# Altium schematic sheet MB1189.SchDoc: MB1189
size A3; Date: 9/24/2014; Author: P.A.; CompanyName: STMicroelectronics; Organization: Microcontrollers Division; Address1: 12, Rue Jules HOROWITZ; Address2: 38019 Grenoble; Address3: FRANCE; DocumentNumber: MB1189; Revision: B-07; SheetNumber: 1; SheetTotal: 12; Project: STM32F469I-DISCO
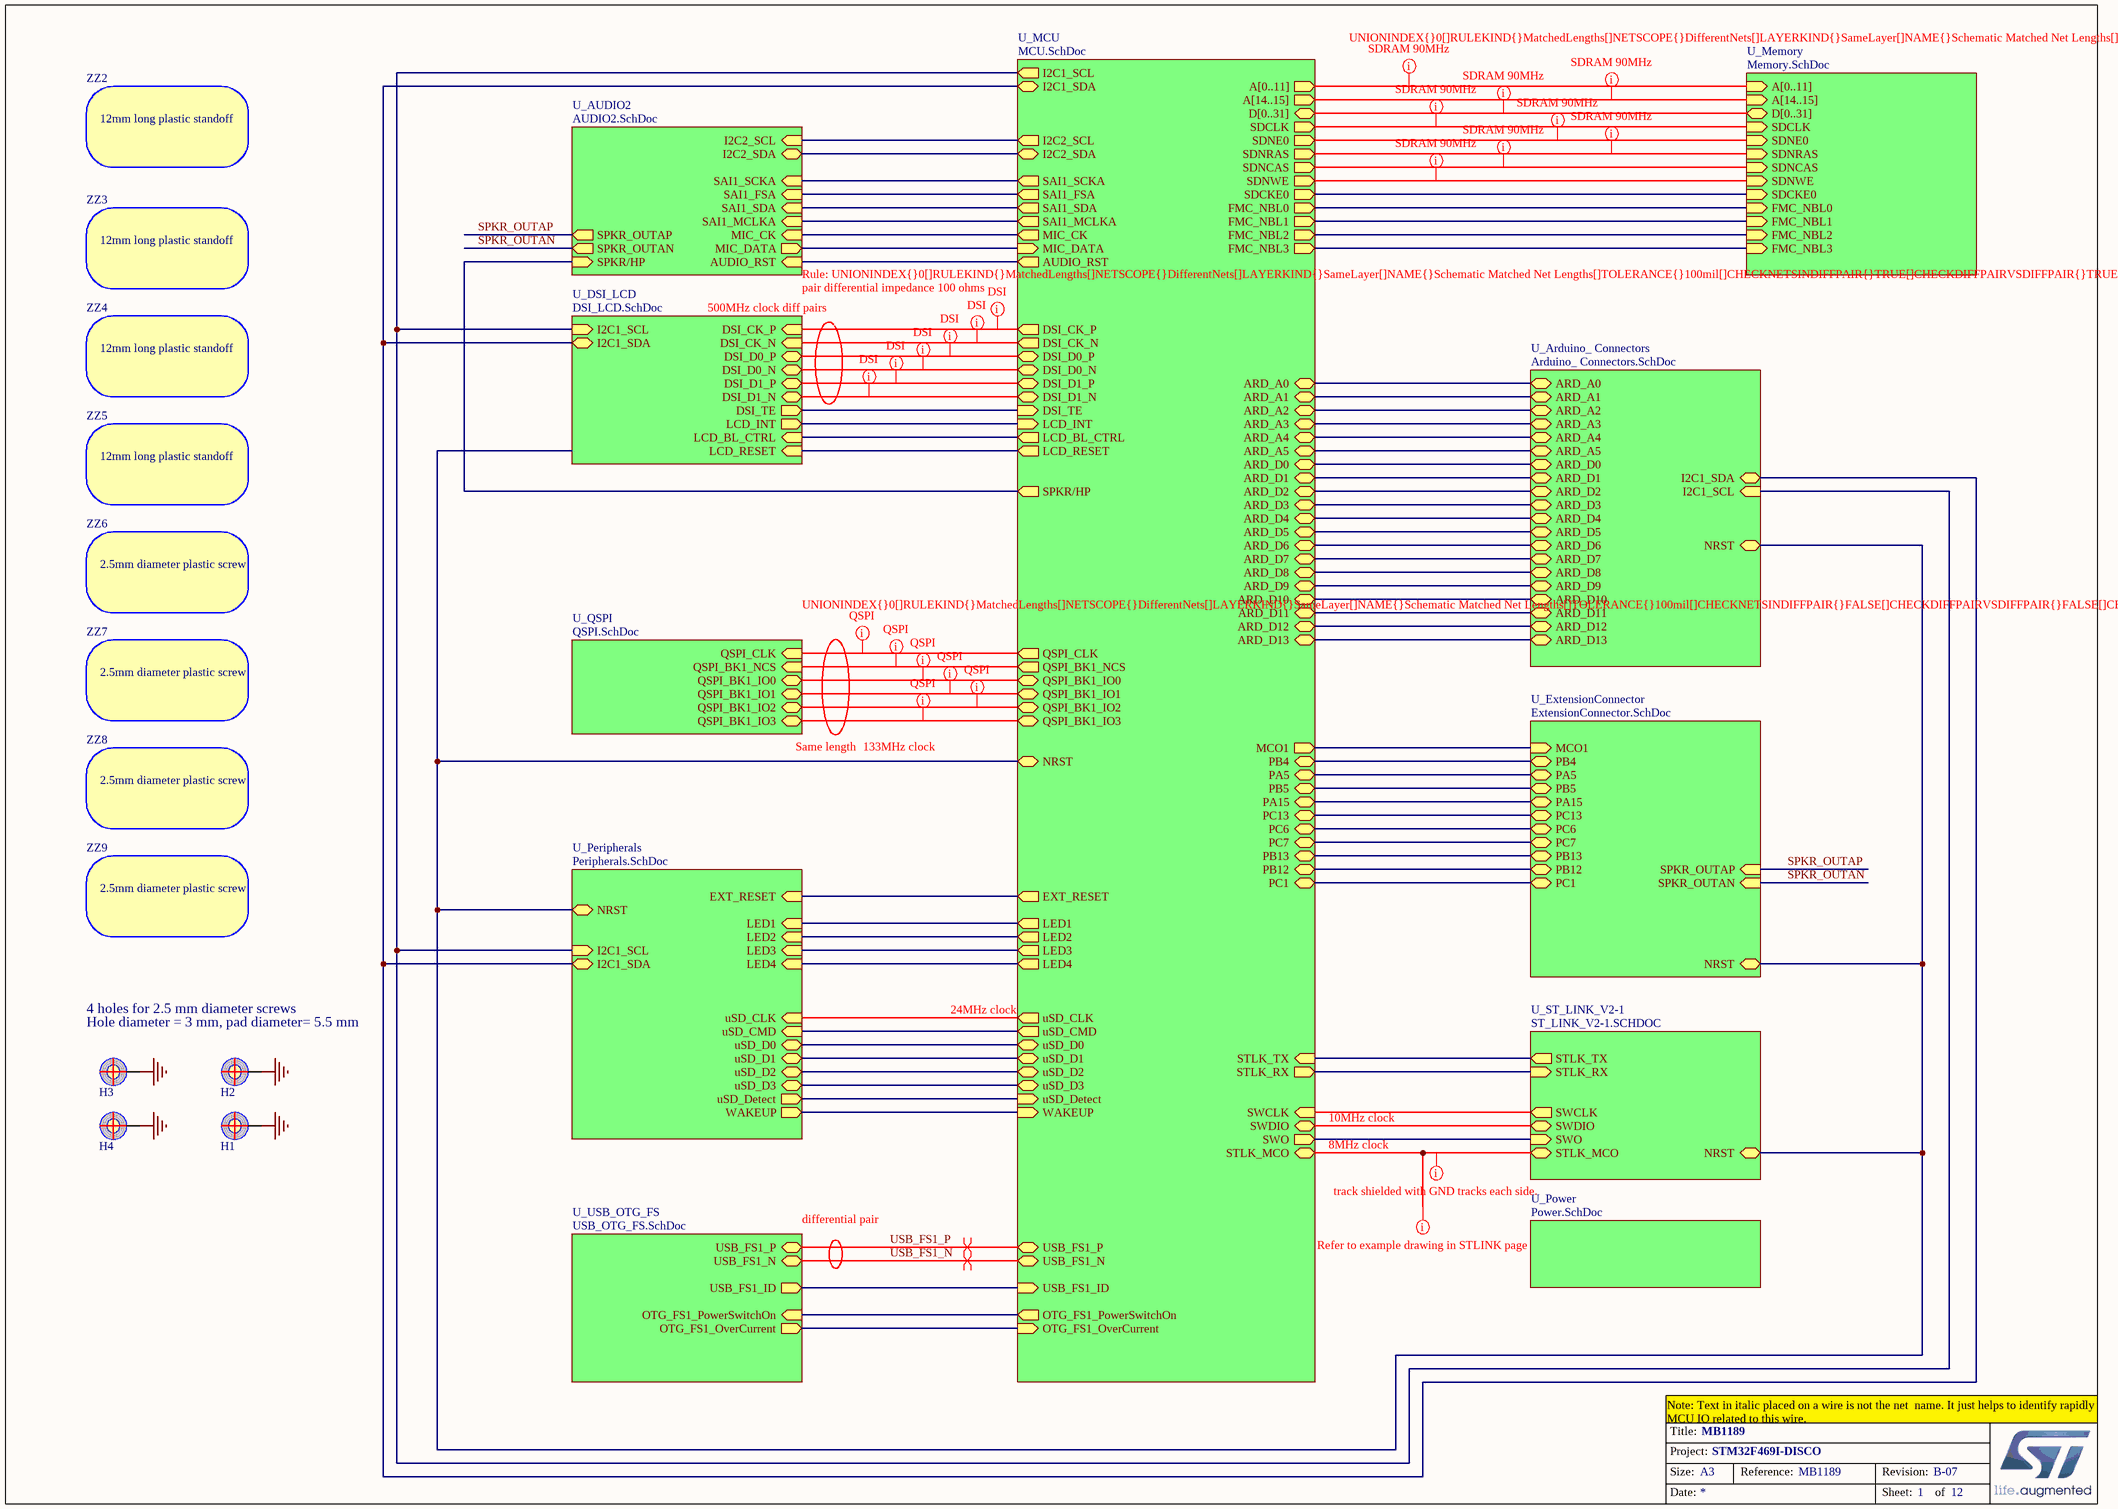
[diagram p0: MB1189.SchDoc]

## Parts
H1  POSITION HOLE  [HOLE_C5R5D3]  (value not drawn)
H2  POSITION HOLE  [HOLE_C5R5D3]  (value not drawn)
H3  POSITION HOLE  [HOLE_C5R5D3]  (value not drawn)
H4  POSITION HOLE  [HOLE_C5R5D3]  (value not drawn)
ZZ2  12mm long plastic standoff
ZZ3  12mm long plastic standoff
ZZ4  12mm long plastic standoff
ZZ5  12mm long plastic standoff
ZZ6  2.5mm diameter plastic screw
ZZ7  2.5mm diameter plastic screw
ZZ8  2.5mm diameter plastic screw
ZZ9  2.5mm diameter plastic screw

## Sub-sheets
U_Arduino_ Connectors = Arduino_ Connectors.SchDoc: I2C1_SDA (bidir), ARD_A0 (bidir), ARD_A1 (bidir), ARD_A2 (bidir), ARD_A3 (bidir), ARD_A4 (bidir), ARD_A5 (bidir), ARD_D5 (bidir), ARD_D4 (bidir), ARD_D3 (bidir), ARD_D2 (bidir), ARD_D1 (bidir), ARD_D0 (bidir), ARD_D13 (bidir), ARD_D12 (bidir), ARD_D11 (bidir), ARD_D10 (bidir), ARD_D9 (bidir), ARD_D8 (bidir), ARD_D6 (bidir), ARD_D7 (bidir), I2C1_SCL (in), NRST (bidir)
U_AUDIO2 = AUDIO2.SchDoc: SAI1_SCKA (in), SAI1_FSA (in), SAI1_SDA (in), AUDIO_RST (in), SAI1_MCLKA (in), I2C2_SCL (in), I2C2_SDA (bidir), MIC_CK (in), MIC_DATA (out), SPKR_OUTAP (out), SPKR_OUTAN (out), SPKR/HP (in)
U_DSI_LCD = DSI_LCD.SchDoc: DSI_CK_P (in), DSI_CK_N (in), DSI_D0_P (bidir), DSI_D0_N (bidir), DSI_D1_P (bidir), DSI_D1_N (bidir), DSI_TE (out), I2C1_SDA (bidir), I2C1_SCL (in), LCD_BL_CTRL (in), LCD_INT (out), LCD_RESET (in)
U_ExtensionConnector = ExtensionConnector.SchDoc: SPKR_OUTAP (in), SPKR_OUTAN (in), NRST (bidir), MCO1 (in), PB4 (bidir), PA5 (bidir), PB5 (bidir), PA15 (bidir), PC13 (bidir), PC7 (bidir), PC6 (bidir), PB13 (bidir), PB12 (bidir), PC1 (bidir)
U_MCU = MCU.SchDoc: LCD_BL_CTRL (out), MIC_CK (out), I2C1_SCL (out), I2C1_SDA (bidir), uSD_D0 (bidir), uSD_D1 (bidir), uSD_D2 (bidir), EXT_RESET (out), uSD_D3 (bidir), uSD_CLK (out), uSD_CMD (out), FMC_NBL3 (out), FMC_NBL2 (out), FMC_NBL0 (out), FMC_NBL1 (out), SAI1_SDA (out), SAI1_SCKA (out), SAI1_FSA (out), SAI1_MCLKA (out), SDNRAS (out), SDCLK (out), SDNCAS (out), SDCKE0 (out), SDNE0 (out), SDNWE (out), D[0..31] (bidir), QSPI_CLK (out), QSPI_BK1_NCS (out), QSPI_BK1_IO3 (bidir), QSPI_BK1_IO2 (bidir), QSPI_BK1_IO1 (bidir), QSPI_BK1_IO0 (bidir), WAKEUP (in), DSI_TE (in), DSI_CK_P (out), DSI_CK_N (out), DSI_D0_P (bidir), DSI_D0_N (bidir), DSI_D1_P (bidir), DSI_D1_N (bidir), NRST (bidir), LCD_INT (in), LED1 (out), LED2 (out), LED3 (out), LED4 (out), uSD_Detect (in), STLK_TX (in), STLK_RX (out), ARD_D5 (bidir), ARD_D4 (bidir), ARD_D3 (bidir), ARD_D2 (bidir), ARD_D1 (bidir), ARD_D0 (bidir), ARD_D13 (bidir), ARD_D12 (bidir), ARD_D11 (bidir), ARD_D10 (bidir), ARD_D9 (bidir), ARD_D8 (bidir), ARD_D6 (bidir), ARD_D7 (bidir), ARD_A0 (bidir), ARD_A1 (bidir), ARD_A2 (bidir), ARD_A3 (bidir), ARD_A4 (bidir), ARD_A5 (bidir), SWCLK (in), SWO (out), AUDIO_RST (out), USB_FS1_ID (in), OTG_FS1_PowerSwitchOn (out), OTG_FS1_OverCurrent (in), I2C2_SCL (out), I2C2_SDA (bidir), MIC_DATA (in), MCO1 (out), USB_FS1_N (bidir), USB_FS1_P (bidir), SWDIO, SPKR/HP (out), A[0..11] (out), A[14..15] (out), PB4 (bidir), PB5 (bidir), PA5 (bidir), PA15 (bidir), PC7 (bidir), PC6 (bidir), PC13 (bidir), PB12 (bidir), PB13 (bidir), PC1 (bidir), LCD_RESET (out), STLK_MCO
U_Memory = Memory.SchDoc: FMC_NBL0 (in), FMC_NBL1 (in), D[0..31] (bidir), SDNCAS (in), SDNWE (in), SDNRAS (in), SDNE0 (in), SDCKE0 (in), SDCLK (in), FMC_NBL3 (in), FMC_NBL2 (in), A[0..11] (in), A[14..15] (in)
U_Peripherals = Peripherals.SchDoc: uSD_CLK (in), uSD_CMD (in), uSD_D0 (bidir), uSD_D1 (bidir), uSD_D2 (bidir), uSD_D3 (bidir), WAKEUP (out), EXT_RESET (in), LED1 (in), LED2 (in), LED3 (in), LED4 (in), NRST (bidir), uSD_Detect (out), I2C1_SDA (bidir), I2C1_SCL (in)
U_Power = Power.SchDoc: no entries
U_QSPI = QSPI.SchDoc: QSPI_BK1_IO0 (bidir), QSPI_BK1_IO2 (bidir), QSPI_BK1_IO1 (bidir), QSPI_CLK (in), QSPI_BK1_NCS (in), QSPI_BK1_IO3 (bidir)
U_ST_LINK_V2-1 = ST_LINK_V2-1.SCHDOC: STLK_RX (in), STLK_TX (out), SWDIO, SWO (in), SWCLK (out), NRST (bidir), STLK_MCO
U_USB_OTG_FS = USB_OTG_FS.SchDoc: OTG_FS1_PowerSwitchOn (in), OTG_FS1_OverCurrent (out), USB_FS1_ID (out), USB_FS1_N (bidir), USB_FS1_P (bidir)

## Nets
GND: H1.1 H2.1 H3.1 H4.1
SPKR_OUTAN: sheet U_AUDIO2/SPKR_OUTAN, sheet U_ExtensionConnector/SPKR_OUTAN
SPKR_OUTAP: sheet U_AUDIO2/SPKR_OUTAP, sheet U_ExtensionConnector/SPKR_OUTAP
USB_FS1_N: sheet U_MCU/USB_FS1_N, sheet U_USB_OTG_FS/USB_FS1_N
USB_FS1_P: sheet U_MCU/USB_FS1_P, sheet U_USB_OTG_FS/USB_FS1_P
(unnamed): sheet U_Memory/FMC_NBL0, sheet U_MCU/FMC_NBL0
(unnamed): sheet U_Memory/FMC_NBL1, sheet U_MCU/FMC_NBL1
(unnamed): sheet U_Memory/SDNCAS, sheet U_MCU/SDNCAS
(unnamed): sheet U_Memory/SDNWE, sheet U_MCU/SDNWE
(unnamed): sheet U_Memory/SDNRAS, sheet U_MCU/SDNRAS
(unnamed): sheet U_Memory/SDNE0, sheet U_MCU/SDNE0
(unnamed): sheet U_Memory/SDCKE0, sheet U_MCU/SDCKE0
(unnamed): sheet U_Memory/SDCLK, sheet U_MCU/SDCLK
(unnamed): sheet U_Memory/FMC_NBL3, sheet U_MCU/FMC_NBL3
(unnamed): sheet U_Memory/FMC_NBL2, sheet U_MCU/FMC_NBL2
(unnamed): sheet U_Peripherals/uSD_CLK, sheet U_MCU/uSD_CLK
(unnamed): sheet U_Peripherals/uSD_CMD, sheet U_MCU/uSD_CMD
(unnamed): sheet U_Peripherals/uSD_D0, sheet U_MCU/uSD_D0
(unnamed): sheet U_Peripherals/uSD_D1, sheet U_MCU/uSD_D1
(unnamed): sheet U_Peripherals/uSD_D2, sheet U_MCU/uSD_D2
(unnamed): sheet U_Peripherals/uSD_D3, sheet U_MCU/uSD_D3
(unnamed): sheet U_Peripherals/WAKEUP, sheet U_MCU/WAKEUP
(unnamed): sheet U_Peripherals/EXT_RESET, sheet U_MCU/EXT_RESET
(unnamed): sheet U_Peripherals/LED1, sheet U_MCU/LED1
(unnamed): sheet U_Peripherals/LED2, sheet U_MCU/LED2
(unnamed): sheet U_Peripherals/LED3, sheet U_MCU/LED3
(unnamed): sheet U_Peripherals/LED4, sheet U_MCU/LED4
(unnamed): sheet U_Peripherals/NRST, sheet U_ST_LINK_V2-1/NRST, sheet U_MCU/NRST, sheet U_Arduino_ Connectors/NRST, sheet U_ExtensionConnector/NRST
(unnamed): sheet U_Peripherals/uSD_Detect, sheet U_MCU/uSD_Detect
(unnamed): sheet U_Peripherals/I2C1_SDA, sheet U_MCU/I2C1_SDA, sheet U_Arduino_ Connectors/I2C1_SDA, sheet U_DSI_LCD/I2C1_SDA
(unnamed): sheet U_Peripherals/I2C1_SCL, sheet U_MCU/I2C1_SCL, sheet U_Arduino_ Connectors/I2C1_SCL, sheet U_DSI_LCD/I2C1_SCL
(unnamed): sheet U_ST_LINK_V2-1/STLK_RX, sheet U_MCU/STLK_RX
(unnamed): sheet U_ST_LINK_V2-1/STLK_TX, sheet U_MCU/STLK_TX
(unnamed): sheet U_ST_LINK_V2-1/SWDIO, sheet U_MCU/SWDIO
(unnamed): sheet U_ST_LINK_V2-1/SWO, sheet U_MCU/SWO
(unnamed): sheet U_ST_LINK_V2-1/SWCLK, sheet U_MCU/SWCLK
(unnamed): sheet U_ST_LINK_V2-1/STLK_MCO, sheet U_MCU/STLK_MCO
(unnamed): sheet U_MCU/LCD_BL_CTRL, sheet U_DSI_LCD/LCD_BL_CTRL
(unnamed): sheet U_MCU/MIC_CK, sheet U_AUDIO2/MIC_CK
(unnamed): sheet U_MCU/SAI1_SDA, sheet U_AUDIO2/SAI1_SDA
(unnamed): sheet U_MCU/SAI1_SCKA, sheet U_AUDIO2/SAI1_SCKA
(unnamed): sheet U_MCU/SAI1_FSA, sheet U_AUDIO2/SAI1_FSA
(unnamed): sheet U_MCU/SAI1_MCLKA, sheet U_AUDIO2/SAI1_MCLKA
(unnamed): sheet U_MCU/QSPI_CLK, sheet U_QSPI/QSPI_CLK
(unnamed): sheet U_MCU/QSPI_BK1_NCS, sheet U_QSPI/QSPI_BK1_NCS
(unnamed): sheet U_MCU/QSPI_BK1_IO3, sheet U_QSPI/QSPI_BK1_IO3
(unnamed): sheet U_MCU/QSPI_BK1_IO2, sheet U_QSPI/QSPI_BK1_IO2
(unnamed): sheet U_MCU/QSPI_BK1_IO1, sheet U_QSPI/QSPI_BK1_IO1
(unnamed): sheet U_MCU/QSPI_BK1_IO0, sheet U_QSPI/QSPI_BK1_IO0
(unnamed): sheet U_MCU/DSI_TE, sheet U_DSI_LCD/DSI_TE
(unnamed): sheet U_MCU/DSI_CK_P, sheet U_DSI_LCD/DSI_CK_P
(unnamed): sheet U_MCU/DSI_CK_N, sheet U_DSI_LCD/DSI_CK_N
(unnamed): sheet U_MCU/DSI_D0_P, sheet U_DSI_LCD/DSI_D0_P
(unnamed): sheet U_MCU/DSI_D0_N, sheet U_DSI_LCD/DSI_D0_N
(unnamed): sheet U_MCU/DSI_D1_P, sheet U_DSI_LCD/DSI_D1_P
(unnamed): sheet U_MCU/DSI_D1_N, sheet U_DSI_LCD/DSI_D1_N
(unnamed): sheet U_MCU/LCD_INT, sheet U_DSI_LCD/LCD_INT
(unnamed): sheet U_MCU/ARD_D5, sheet U_Arduino_ Connectors/ARD_D5
(unnamed): sheet U_MCU/ARD_D4, sheet U_Arduino_ Connectors/ARD_D4
(unnamed): sheet U_MCU/ARD_D3, sheet U_Arduino_ Connectors/ARD_D3
(unnamed): sheet U_MCU/ARD_D2, sheet U_Arduino_ Connectors/ARD_D2
(unnamed): sheet U_MCU/ARD_D1, sheet U_Arduino_ Connectors/ARD_D1
(unnamed): sheet U_MCU/ARD_D0, sheet U_Arduino_ Connectors/ARD_D0
(unnamed): sheet U_MCU/ARD_D13, sheet U_Arduino_ Connectors/ARD_D13
(unnamed): sheet U_MCU/ARD_D12, sheet U_Arduino_ Connectors/ARD_D12
(unnamed): sheet U_MCU/ARD_D11, sheet U_Arduino_ Connectors/ARD_D11
(unnamed): sheet U_MCU/ARD_D10, sheet U_Arduino_ Connectors/ARD_D10
(unnamed): sheet U_MCU/ARD_D9, sheet U_Arduino_ Connectors/ARD_D9
(unnamed): sheet U_MCU/ARD_D8, sheet U_Arduino_ Connectors/ARD_D8
(unnamed): sheet U_MCU/ARD_D6, sheet U_Arduino_ Connectors/ARD_D6
(unnamed): sheet U_MCU/ARD_D7, sheet U_Arduino_ Connectors/ARD_D7
(unnamed): sheet U_MCU/ARD_A0, sheet U_Arduino_ Connectors/ARD_A0
(unnamed): sheet U_MCU/ARD_A1, sheet U_Arduino_ Connectors/ARD_A1
(unnamed): sheet U_MCU/ARD_A2, sheet U_Arduino_ Connectors/ARD_A2
(unnamed): sheet U_MCU/ARD_A3, sheet U_Arduino_ Connectors/ARD_A3
(unnamed): sheet U_MCU/ARD_A4, sheet U_Arduino_ Connectors/ARD_A4
(unnamed): sheet U_MCU/ARD_A5, sheet U_Arduino_ Connectors/ARD_A5
(unnamed): sheet U_MCU/AUDIO_RST, sheet U_AUDIO2/AUDIO_RST
(unnamed): sheet U_MCU/USB_FS1_ID, sheet U_USB_OTG_FS/USB_FS1_ID
(unnamed): sheet U_MCU/OTG_FS1_PowerSwitchOn, sheet U_USB_OTG_FS/OTG_FS1_PowerSwitchOn
(unnamed): sheet U_MCU/OTG_FS1_OverCurrent, sheet U_USB_OTG_FS/OTG_FS1_OverCurrent
(unnamed): sheet U_MCU/I2C2_SCL, sheet U_AUDIO2/I2C2_SCL
(unnamed): sheet U_MCU/I2C2_SDA, sheet U_AUDIO2/I2C2_SDA
(unnamed): sheet U_MCU/MIC_DATA, sheet U_AUDIO2/MIC_DATA
(unnamed): sheet U_MCU/MCO1, sheet U_ExtensionConnector/MCO1
(unnamed): sheet U_MCU/SPKR/HP, sheet U_AUDIO2/SPKR/HP
(unnamed): sheet U_MCU/PB4, sheet U_ExtensionConnector/PB4
(unnamed): sheet U_MCU/PB5, sheet U_ExtensionConnector/PB5
(unnamed): sheet U_MCU/PA5, sheet U_ExtensionConnector/PA5
(unnamed): sheet U_MCU/PA15, sheet U_ExtensionConnector/PA15
(unnamed): sheet U_MCU/PC7, sheet U_ExtensionConnector/PC7
(unnamed): sheet U_MCU/PC6, sheet U_ExtensionConnector/PC6
(unnamed): sheet U_MCU/PC13, sheet U_ExtensionConnector/PC13
(unnamed): sheet U_MCU/PB12, sheet U_ExtensionConnector/PB12
(unnamed): sheet U_MCU/PB13, sheet U_ExtensionConnector/PB13
(unnamed): sheet U_MCU/PC1, sheet U_ExtensionConnector/PC1
(unnamed): sheet U_MCU/LCD_RESET, sheet U_DSI_LCD/LCD_RESET

## Buses and harness runs
bus sheet U_MCU/A[0..11] = sheet U_Memory/A[0..11]
bus sheet U_MCU/A[14..15] = sheet U_Memory/A[14..15]
bus sheet U_MCU/D[0..31] = sheet U_Memory/D[0..31]

## Layout directives
rule Matched Net Lengths [Tolerance = 250mil]: (no net found under the mark)
rule Matched Net Lengths [Tolerance = 100mil]; rule ? : (no net found under the mark)
rule Matched Net Lengths [Tolerance = 100mil]: (no net found under the mark)
differential pair: USB_FS1_N, USB_FS1_P
mark named track shielded with GND tracks each side.: (no net found under the mark)
mark named Refer to example drawing in STLINK page: (no net found under the mark)

## Notes on the sheet
- 500MHz clock diff pairs
- Same length
- 133MHz clock
- 4 holes for 2.5 mm diameter screws
- Hole diameter = 3 mm, pad diameter= 5.5 mm
- 24MHz clock
- 10MHz clock
- 8MHz clock
- differential pair
- Note: Text in italic placed on a wire is not the net  name. It just helps to identify rapidly MCU IO related to this wire.
- Title:
- Project:
- Size:
- Date:
- A3
- Reference:
- Sheet:
- Revision:
- of

## Library data of the parts
H1-H4 = POSITION HOLE: Ordered by: Subcon
ZZ2-ZZ9 = BoM_Item: Heigth Spacer; Ordered by: Subcon; Assembly: assembled at each corner